# EAGLE schematic payloads (EAGLE 9.0.1)
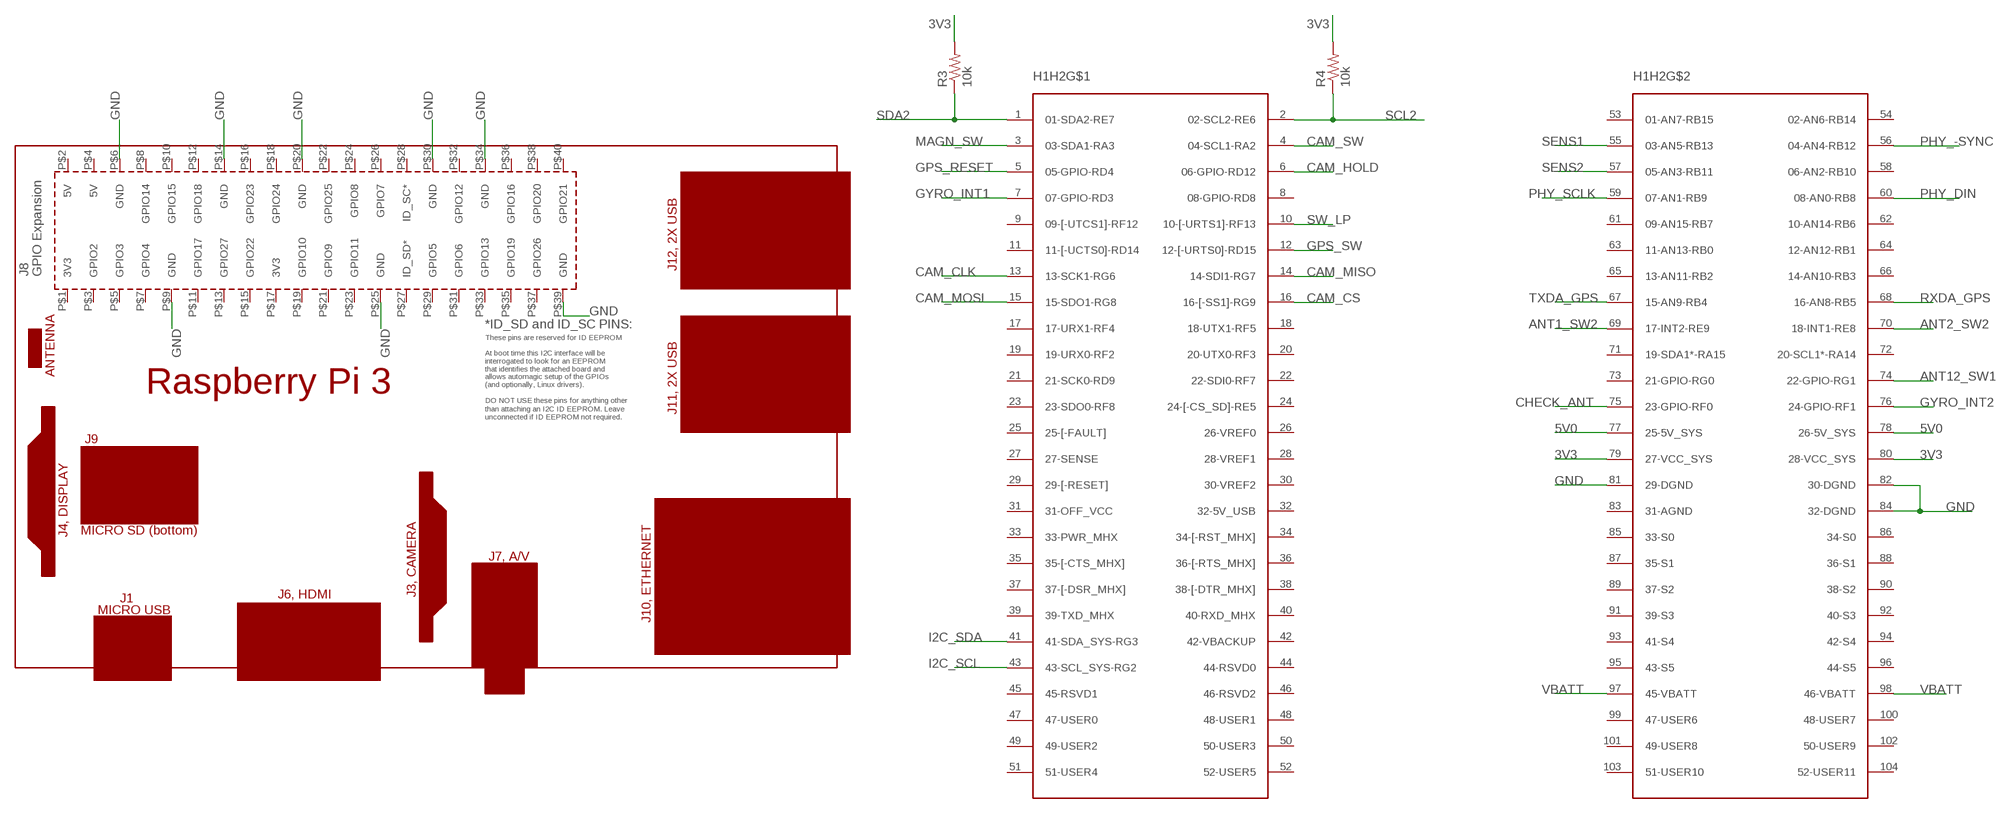
[diagram p0: schematic, sheet 1]

## Parts
H1H2  PC104_CONN  [PC_104]
PCB2  RPI3  [RPI3]
R3  10k  R-US_R0603  [R0603]
R4  10k  R-US_R0603  [R0603]

## Nets
3V3: H1H2.79(27-VCC_SYS) H1H2.80(28-VCC_SYS) R3.2 R4.2
5V0: H1H2.77(25-5V_SYS) H1H2.78(26-5V_SYS)
ANT1_SW2: H1H2.69(17-INT2-RE9)
ANT2_SW2: H1H2.70(18-INT1-RE8)
ANT12_SW1: H1H2.74(22-GPIO-RG1)
CAM_CLK: H1H2.13(13-SCK1-RG6)
CAM_CS: H1H2.16(16-[-SS1]-RG9)
CAM_HOLD: H1H2.6(06-GPIO-RD12)
CAM_MISO: H1H2.14(14-SDI1-RG7)
CAM_MOSI: H1H2.15(15-SDO1-RG8)
CAM_SW: H1H2.4(04-SCL1-RA2)
CHECK_ANT: H1H2.75(23-GPIO-RF0)
GND: H1H2.81(29-DGND) H1H2.82(30-DGND) H1H2.84(32-DGND) PCB2.P$6(GND) PCB2.P$9(GND) PCB2.P$14(GND) PCB2.P$20(GND) PCB2.P$25(GND) PCB2.P$30(GND) PCB2.P$34(GND) PCB2.P$39(GND)
GPS_RESET: H1H2.5(05-GPIO-RD4)
GPS_SW: H1H2.12(12-[-URTS0]-RD15)
GYRO_INT1: H1H2.7(07-GPIO-RD3)
GYRO_INT2: H1H2.76(24-GPIO-RF1)
I2C_SCL: H1H2.43(43-SCL_SYS-RG2)
I2C_SDA: H1H2.41(41-SDA_SYS-RG3)
MAGN_SW: H1H2.3(03-SDA1-RA3)
PHY_-SYNC: H1H2.56(04-AN4-RB12)
PHY_DIN: H1H2.60(08-AN0-RB8)
PHY_SCLK: H1H2.59(07-AN1-RB9)
RXDA_GPS: H1H2.68(16-AN8-RB5)
SCL2: H1H2.2(02-SCL2-RE6) R4.1
SDA2: H1H2.1(01-SDA2-RE7) R3.1
SENS1: H1H2.55(03-AN5-RB13)
SENS2: H1H2.57(05-AN3-RB11)
SW_LP: H1H2.10(10-[-URTS1]-RF13)
TXDA_GPS: H1H2.67(15-AN9-RB4)
VBATT: H1H2.97(45-VBATT) H1H2.98(46-VBATT)
Unconnected: H1H2.8(08-GPIO-RD8) H1H2.9(09-[-UTCS1]-RF12) H1H2.11(11-[-UCTS0]-RD14) H1H2.17(17-URX1-RF4) H1H2.18(18-UTX1-RF5) H1H2.19(19-URX0-RF2) H1H2.20(20-UTX0-RF3) H1H2.21(21-SCK0-RD9) H1H2.22(22-SDI0-RF7) H1H2.23(23-SDO0-RF8) H1H2.24(24-[-CS_SD]-RE5) H1H2.25(25-[-FAULT]) H1H2.26(26-VREF0) H1H2.27(27-SENSE) H1H2.28(28-VREF1) H1H2.29(29-[-RESET]) H1H2.30(30-VREF2) H1H2.31(31-OFF_VCC) H1H2.32(32-5V_USB) H1H2.33(33-PWR_MHX) H1H2.34(34-[-RST_MHX]) H1H2.35(35-[-CTS_MHX]) H1H2.36(36-[-RTS_MHX]) H1H2.37(37-[-DSR_MHX]) H1H2.38(38-[-DTR_MHX]) H1H2.39(39-TXD_MHX) H1H2.40(40-RXD_MHX) H1H2.42(42-VBACKUP) H1H2.44(44-RSVD0) H1H2.45(45-RSVD1) H1H2.46(46-RSVD2) H1H2.47(47-USER0) H1H2.48(48-USER1) H1H2.49(49-USER2) H1H2.50(50-USER3) H1H2.51(51-USER4) H1H2.52(52-USER5) H1H2.53(01-AN7-RB15) H1H2.54(02-AN6-RB14) H1H2.58(06-AN2-RB10) H1H2.61(09-AN15-RB7) H1H2.62(10-AN14-RB6) H1H2.63(11-AN13-RB0) H1H2.64(12-AN12-RB1) H1H2.65(13-AN11-RB2) H1H2.66(14-AN10-RB3) H1H2.71(19-SDA1*-RA15) H1H2.72(20-SCL1*-RA14) H1H2.73(21-GPIO-RG0) H1H2.83(31-AGND) H1H2.85(33-S0) H1H2.86(34-S0) H1H2.87(35-S1) H1H2.88(36-S1) H1H2.89(37-S2) H1H2.90(38-S2) H1H2.91(39-S3) H1H2.92(40-S3) H1H2.93(41-S4) H1H2.94(42-S4) H1H2.95(43-S5) H1H2.96(44-S5) H1H2.99(47-USER6) H1H2.100(48-USER7) H1H2.101(49-USER8) H1H2.102(50-USER9) H1H2.103(51-USER10) H1H2.104(52-USER11) PCB2.P$1(3V3) PCB2.P$2(5V) PCB2.P$3(GPIO2) PCB2.P$4(5V) PCB2.P$5(GPIO3) PCB2.P$7(GPIO4) PCB2.P$8(GPIO14) PCB2.P$10(GPIO15) PCB2.P$11(GPIO17) PCB2.P$12(GPIO18) PCB2.P$13(GPIO27) PCB2.P$15(GPIO22) PCB2.P$16(GPIO23) PCB2.P$17(3V3) PCB2.P$18(GPIO24) PCB2.P$19(GPIO10) PCB2.P$21(GPIO9) PCB2.P$22(GPIO25) PCB2.P$23(GPIO11) PCB2.P$24(GPIO8) PCB2.P$26(GPIO7) PCB2.P$27(ID_SD*) PCB2.P$28(ID_SC*) PCB2.P$29(GPIO5) PCB2.P$31(GPIO6) PCB2.P$32(GPIO12) PCB2.P$33(GPIO13) PCB2.P$35(GPIO19) PCB2.P$36(GPIO16) PCB2.P$37(GPIO26) PCB2.P$38(GPIO20) PCB2.P$40(GPIO21)

## Library data of the parts
H1H2 = SUCHAI:PC104_CONN
PCB2 = e14_Rpi3_RevA:RPI3: Device for Raspberry Pi 3 board created by Dave Young for www.element14.com More information and support community is available at https://www.element14.com/community/community/raspberry-pi
R3 R4 = rcl:R-US_: RESISTOR, American symbol